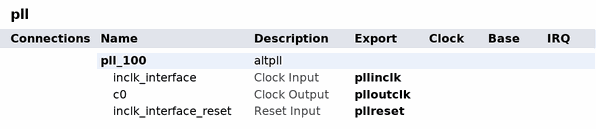
[diagram p0: system contents]
# Platform Designer (Qsys) system pll, Cyclone IV E EP4CE6E22C8
# Parameters at their usual value, and those the tool derives, are not listed.
package require qsys
create_system pll
set_project_property DEVICE_FAMILY {Cyclone IV E}
set_project_property DEVICE EP4CE6E22C8

add_instance pll_100 altpll 13.1
set_instance_parameter_value pll_100 INCLK0_INPUT_FREQUENCY 20000
set_instance_parameter_value pll_100 OPERATION_MODE NO_COMPENSATION
set_instance_parameter_value pll_100 CLK0_MULTIPLY_BY 2
set_instance_parameter_value pll_100 CLK0_DIVIDE_BY 1
set_instance_parameter_value pll_100 PORT_clk1 PORT_UNUSED
set_instance_parameter_value pll_100 PORT_clk2 PORT_UNUSED
set_instance_parameter_value pll_100 PORT_clk3 PORT_UNUSED
set_instance_parameter_value pll_100 PORT_ARESET PORT_USED
set_instance_parameter_value pll_100 PORT_LOCKED PORT_UNUSED

# exported interfaces
add_interface pllinclk clock sink
set_interface_property pllinclk EXPORT_OF pll_100.inclk_interface
add_interface pllreset reset sink
set_interface_property pllreset EXPORT_OF pll_100.inclk_interface_reset
add_interface plloutclk clock source
set_interface_property plloutclk EXPORT_OF pll_100.c0

set_interconnect_requirement {$system} qsys_mm.clockCrossingAdapter HANDSHAKE
set_interconnect_requirement {$system} qsys_mm.maxAdditionalLatency 1
set_interconnect_requirement {$system} qsys_mm.insertDefaultSlave false

save_system pll.qsys
